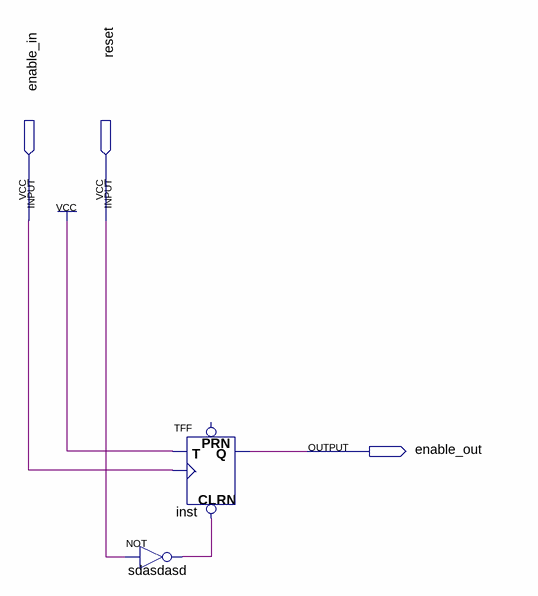
[diagram p0: schematic sheet]
// Quartus schematic enable_flip_flop.bdf as structural Verilog: 2 symbols, 3 pins
module enable_flip_flop (
  input  enable_in,
  input  reset,
  output enable_out
);

  wire sdasdasd_out;

  not sdasdasd (sdasdasd_out, reset);
  TFF inst (.CLRN(sdasdasd_out), .T(1'b1), .CLK(enable_in), .Q(enable_out));  // open: PRN
endmodule
